# Altium schematic sheet 02-Clocks.SchDoc
size A; SheetNumber: 2; SheetTotal: 11
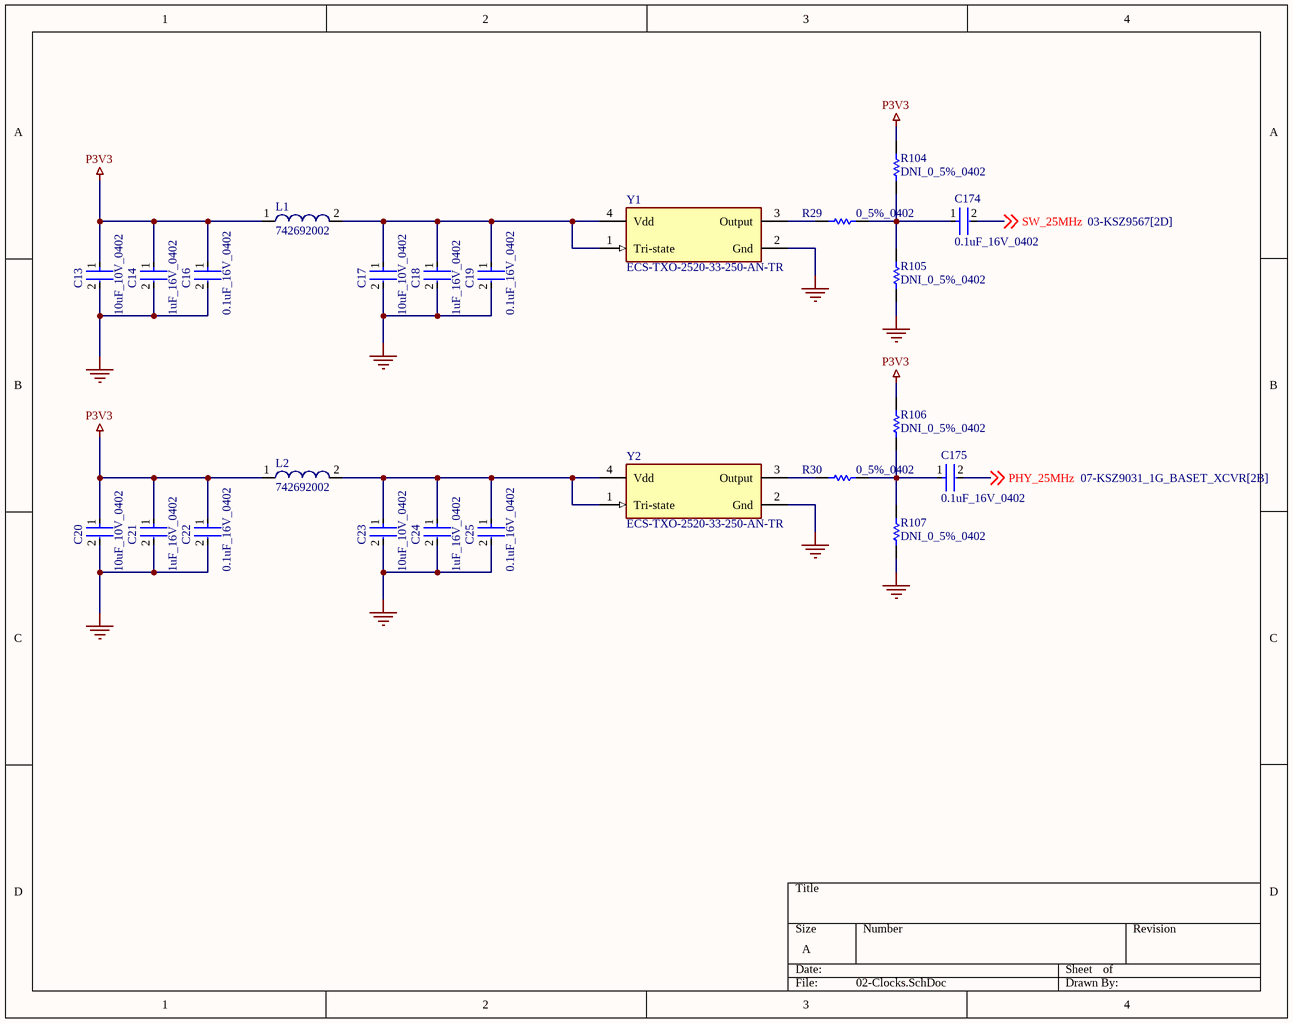
[diagram p0: 02-Clocks.SchDoc]

## Parts
C13  10uF_10V_0402  [FP-CL05A106MP5NUNC-MFG]
C14  1uF_16V_0402  [FP-0402-L_1_0_0_05-W_0_5-IPC_A]
C16  0.1uF_16V_0402  [FP-C0402-BB-MFG]
C17  10uF_10V_0402  [FP-CL05A106MP5NUNC-MFG]
C18  1uF_16V_0402  [FP-0402-L_1_0_0_05-W_0_5-IPC_A]
C19  0.1uF_16V_0402  [FP-C0402-BB-MFG]
C20  10uF_10V_0402  [FP-CL05A106MP5NUNC-MFG]
C21  1uF_16V_0402  [FP-0402-L_1_0_0_05-W_0_5-IPC_A]
C22  0.1uF_16V_0402  [FP-C0402-BB-MFG]
C23  10uF_10V_0402  [FP-CL05A106MP5NUNC-MFG]
C24  1uF_16V_0402  [FP-0402-L_1_0_0_05-W_0_5-IPC_A]
C25  0.1uF_16V_0402  [FP-C0402-BB-MFG]
C174  0.1uF_16V_0402  [FP-C0402-BB-MFG]
C175  0.1uF_16V_0402  [FP-C0402-BB-MFG]
L1  742692002  [WE-TMSB 0201]
L2  742692002  [WE-TMSB 0201]
R29  0_5%_0402  [RESC1005X40X25NL05T10]
R30  0_5%_0402  [RESC1005X40X25NL05T10]
R104  DNI_0_5%_0402  [RESC1005X40X25NL05T10]  (no BOM)
R105  DNI_0_5%_0402  [RESC1005X40X25NL05T10]  (no BOM)
R106  DNI_0_5%_0402  [RESC1005X40X25NL05T10]  (no BOM)
R107  DNI_0_5%_0402  [RESC1005X40X25NL05T10]  (no BOM)
Y1  ECS-TXO-2520-33-250-AN-TR  [FP-ECS-TXO-2520-MFG]
Y2  ECS-TXO-2520-33-250-AN-TR  [FP-ECS-TXO-2520-MFG]

## Nets
GND: C13.2 C14.2 C16.2 C17.2 C18.2 C19.2 C20.2 C21.2 C22.2 C23.2 C24.2 C25.2 R105.1 R107.1 Y1.2(Gnd) Y2.2(Gnd)
P3V3: C13.1 C14.1 C16.1 C20.1 C21.1 C22.1 L1.1 L2.1 R104.2 R106.2
PHY_25MHz: C175.2 ; off-sheet PHY_25MHz
SW_25MHz: C174.2 ; off-sheet SW_25MHz
NetC17_1: C17.1 C18.1 C19.1 L1.2 Y1.1(Tri-state) Y1.4(Vdd)
NetC23_1: C23.1 C24.1 C25.1 L2.2 Y2.1(Tri-state) Y2.4(Vdd)
NetC174_1: C174.1 R29.2 R104.1 R105.2
NetC175_1: C175.1 R30.2 R106.1 R107.2
NetR29_1: R29.1 Y1.3(Output)
NetR30_1: R30.1 Y2.3(Output)

## Library data of the parts
C13 C17 C20 C23 = CMP-13271-000002-1: CAP CER 10UF 10V X5R 0402; Manufacturer Part Number: CL05A106MP5NUNC; Manufacturer: Samsung; Temperature Coefficient: 15%; Tolerance: 20%; Material: Ceramic; Octopart: https://octopart.com/cl05a106mp5nunc-samsung-22457395; Voltage Rating: 10V; RoHS: TRUE; Value: 10uF; Height: 0.7mm; Digikey Description: CAP CER 10UF 10V X5R 0402; Automotive: No; Package: CL05A106MP5NUNC; Device Class L1: Passive Components; Capacitance: 10uF; Temperature Range High: +85°C; ComponentLink2Description: Datasheet; Device Class L2: Capacitors; Temperature Characteristic: X5R; Temperature: -55°C to +85°C; ComponentLink2URL: http://www.samsungsem.com/kr/support/product-search/mlcc/__icsFiles/afieldfile/2019/05/10/19-CL05A106MP5NUNC.pdf; Device Class L3: Ceramic Capacitors; Category: Cap; Temperature Range Low: -55°C; Ipc Land Pattern Name: CAPC10050X50; Lead Free: Yes
C14 C18 C21 C24 = CMP-14477-000104-2: None; Tolerance: 10%; Voltage Rating: 16V; Dielectric: X5R; Capacitance: 1uF; Packaging: Tape and Reel; Depth: 0.5mm; Mount: Surface Mount; Thickness: 0.022inch; Package Quantity: 1; Min Operating Temperature: -55°C; Series: M; Voltage Rating (DC): 16V; Termination: SMD/SMT; Case/Package: 0402; Number of Pins: 2; Case Code (Imperial): 0402; Length: 1mm; Halogen Free: Halogen Free; Case Code (Metric): 1005; Width: 0.02inch; RoHS Compliant: Yes; Radiation Hardening: No; Max Operating Temperature: 85°C; Height: 0.5mm; Construction: Flat
C16 C19 C22 C25 C174 C175 = CMP-1034-02068-3: CAP CER 0.1UF 16V 5% X7R 0402; Manufacturer: Kemet; Manufacturer Part Number: C0402C104J4RACTU; Value: 0.10 μF; Temperature Coefficient: 15%; Tolerance: 0.05; Material: Ceramic; ComponentLink2URL: https://content.kemet.com/datasheets/KEM_C1002_X7R_SMD.pdf; Automotive: No; Device Class L2: Capacitors; Temperature: -55°C to +125°C; RoHS: TRUE; Voltage Rating: 16 V; ComponentLink2Description: Datasheet; Device Class L3: Ceramic Capacitors; Temperature Range Low: -55°C; Ipc Land Pattern Name: CAPC10050X50; Device Class L1: Passive Components; Temperature Range High: +125°C; Package: C0402-BB; Capacitance: 0.10 μF; Category: Cap; Mouser Description: CAP CER 0.1UF 16V X7R 0402; Height: 0.55mm; Digikey Description: CAP CER 0.1UF 16V 5% X7R 0402; Octopart: https://octopart.com/c0402c104j4ractu-kemet-12573893; Temperature Characteristic: X7R; Lead Free: Yes
L1 L2 = CMP-1490-00001-1: Tiny Multilayer Suppression  Bead  WE-TMSB, Z= 60 Ohm; Manufacturer: Wuerth Elektronik; Impedance: 60 Ohm; PartNumber: 742692002; PackageReference: WE-TMSB 0201; ComponentLink1Description: Manufacturer URL; ComponentLink2URL: http://www.we-online.de/katalog/media/pdf/742692002.pdf; ComponentLink1URL: http://www.we-online.com; ComponentLink2Description: Datasheet
R29 R30 R104-R107 = CMP-2002-06457-1: Manufacturer: Panasonic; Part Number: ERJ-U020R00X
Y1 Y2 = CMP-40224-000034-1: XTAL OSC TCXO 25.0000MHZ HCMOS; RoHS Compliant: Yes